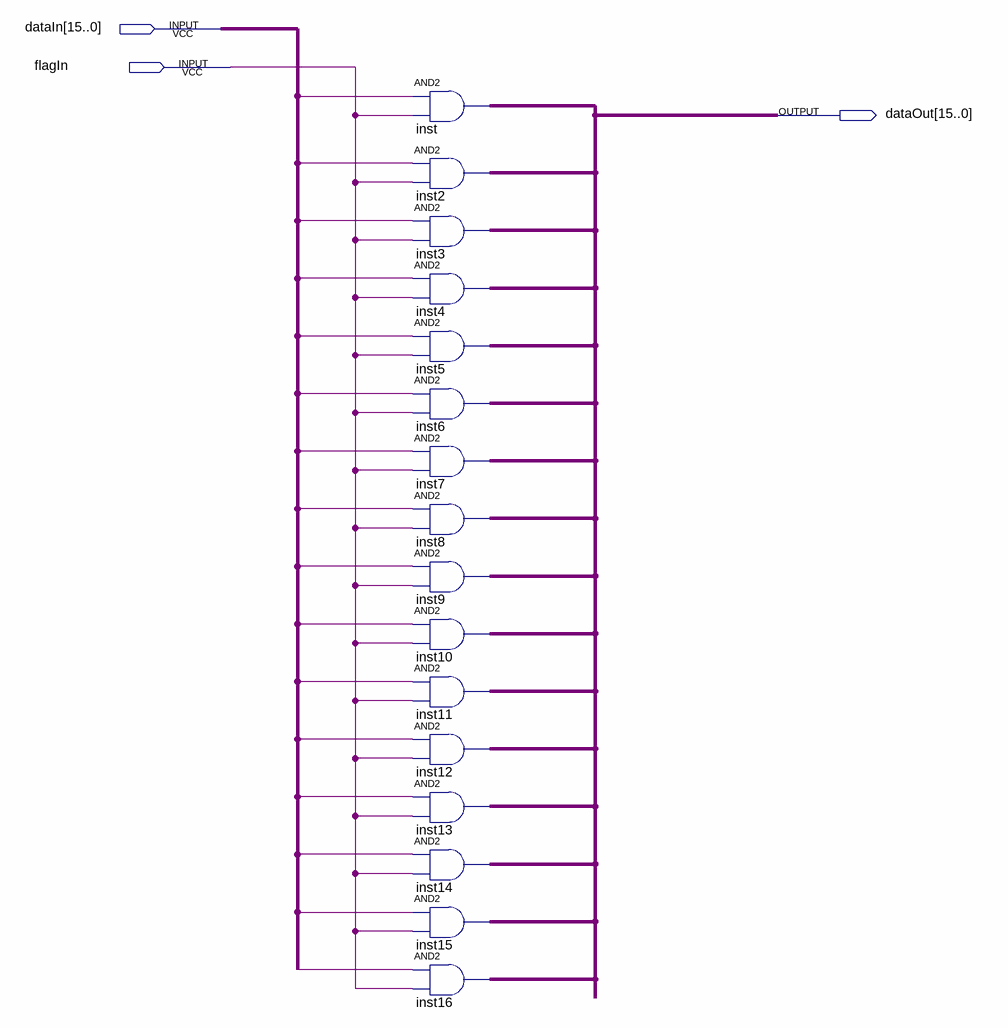
[diagram p0: schematic sheet]
// Quartus schematic dataselector1.bdf as structural Verilog: 16 symbols, 3 pins
module dataselector1 (
  input  [15:0] dataIn,
  input  flagIn,
  output [15:0] dataOut
);

  wire undriven, undriven_2, undriven_3, undriven_4, undriven_5, undriven_6, undriven_7, undriven_8,
       undriven_9, undriven_10, undriven_11, undriven_12, undriven_13, undriven_14, undriven_15, undriven_16;

  assign dataOut = {16{undriven_16}} & {16{flagIn}};  // AND2 inst, 16 bits wide
  assign dataOut = {16{undriven}} & {16{flagIn}};  // AND2 inst2, 16 bits wide
  assign dataOut = {16{undriven_2}} & {16{flagIn}};  // AND2 inst3, 16 bits wide
  assign dataOut = {16{undriven_3}} & {16{flagIn}};  // AND2 inst4, 16 bits wide
  assign dataOut = {16{undriven_4}} & {16{flagIn}};  // AND2 inst5, 16 bits wide
  assign dataOut = {16{undriven_5}} & {16{flagIn}};  // AND2 inst6, 16 bits wide
  assign dataOut = {16{undriven_6}} & {16{flagIn}};  // AND2 inst7, 16 bits wide
  assign dataOut = {16{undriven_7}} & {16{flagIn}};  // AND2 inst8, 16 bits wide
  assign dataOut = {16{undriven_8}} & {16{flagIn}};  // AND2 inst9, 16 bits wide
  assign dataOut = {16{undriven_9}} & {16{flagIn}};  // AND2 inst10, 16 bits wide
  assign dataOut = {16{undriven_10}} & {16{flagIn}};  // AND2 inst11, 16 bits wide
  assign dataOut = {16{undriven_11}} & {16{flagIn}};  // AND2 inst12, 16 bits wide
  assign dataOut = {16{undriven_12}} & {16{flagIn}};  // AND2 inst13, 16 bits wide
  assign dataOut = {16{undriven_13}} & {16{flagIn}};  // AND2 inst14, 16 bits wide
  assign dataOut = {16{undriven_14}} & {16{flagIn}};  // AND2 inst15, 16 bits wide
  assign dataOut = {16{undriven_15}} & {16{flagIn}};  // AND2 inst16, 16 bits wide
endmodule
